# EAGLE schematic brick_i2c_3axis (EAGLE 7.2.0)
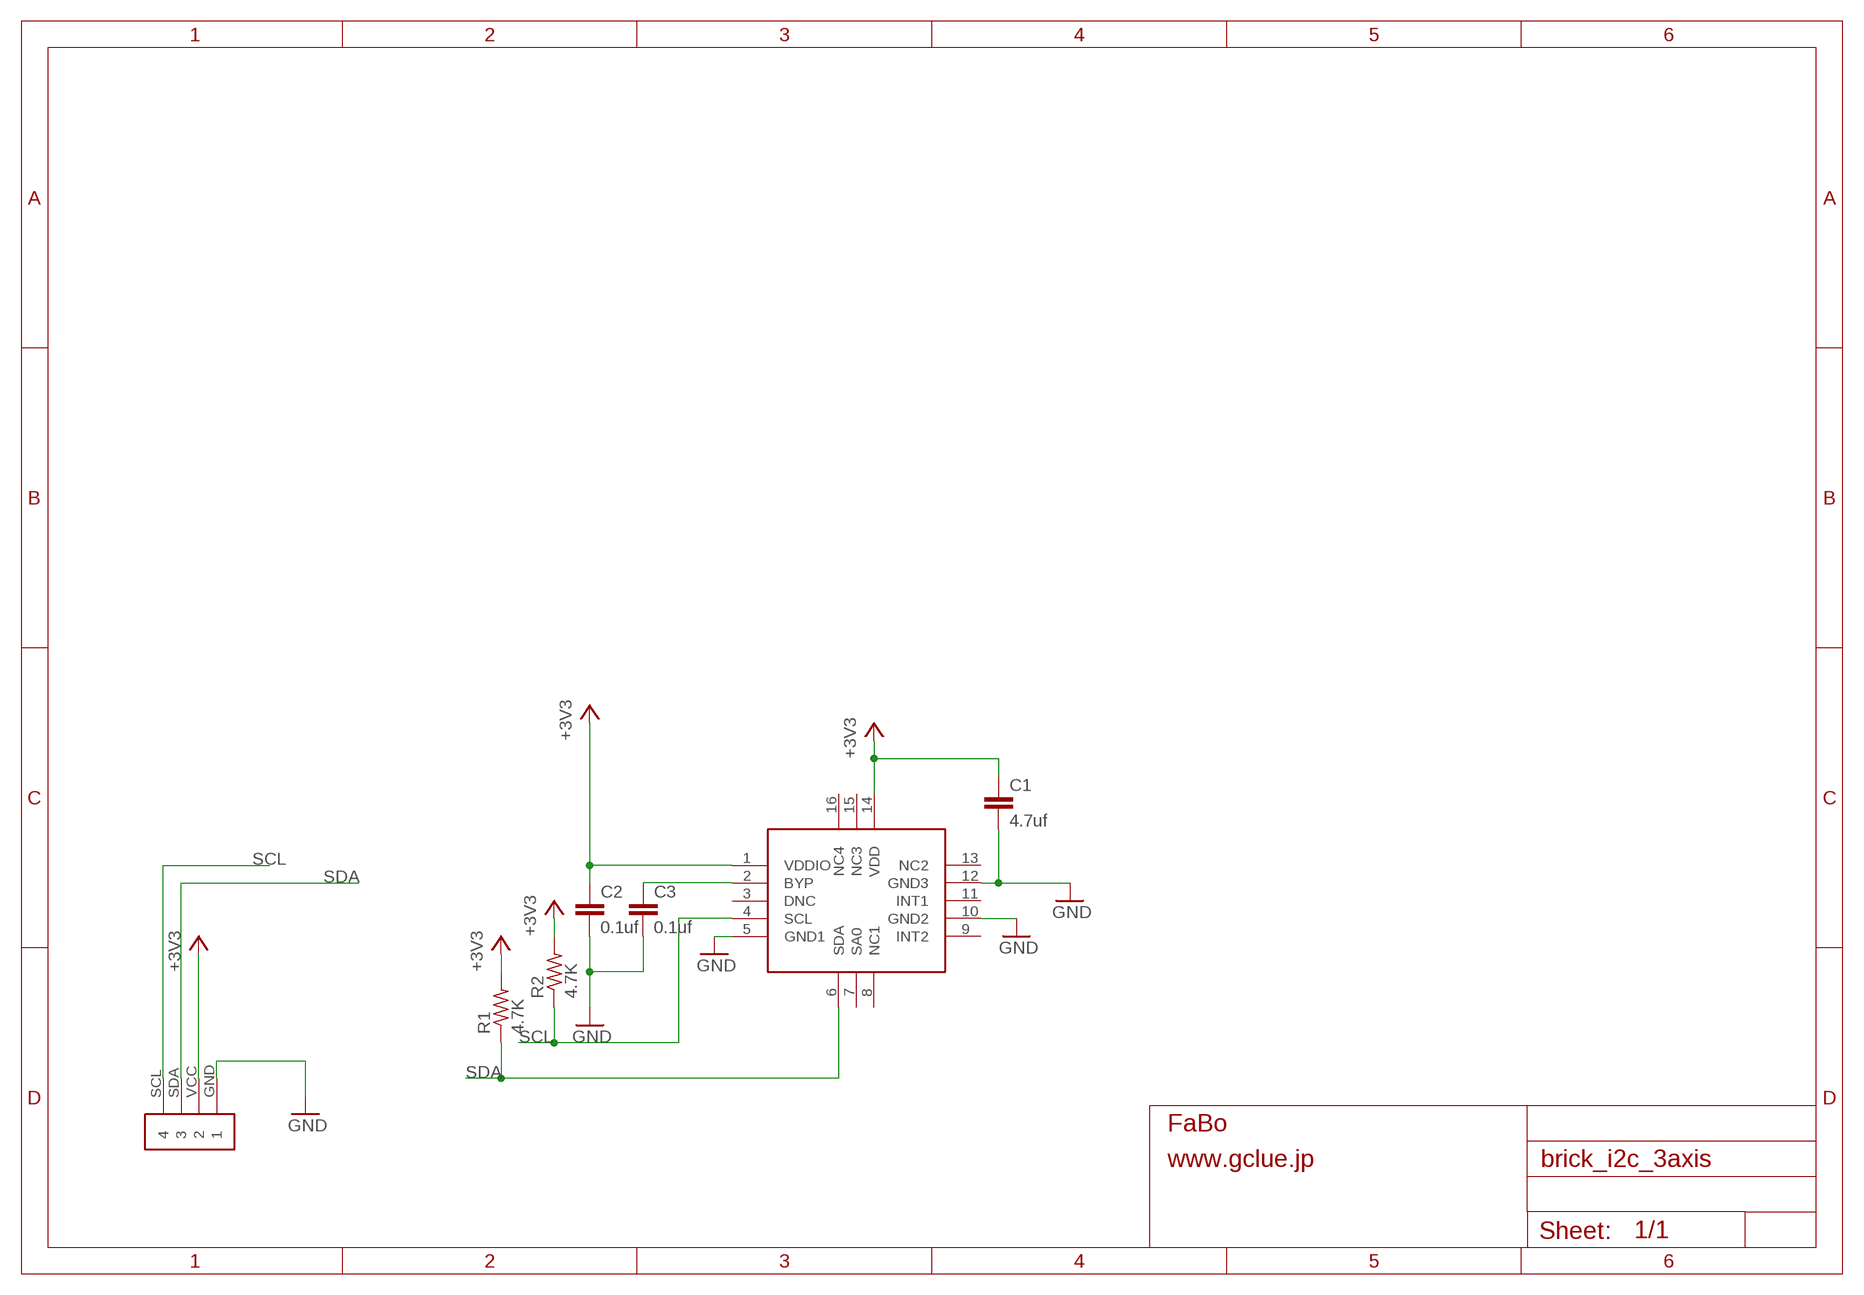
[diagram p0: schematic, sheet 1]

## Parts
C1  4.7uf  C-EUC0603  [C0603]
C2  0.1uf  C-EUC0603  [C0603]
C3  0.1uf  C-EUC0603  [C0603]
MMA1  FREESCALE-MMA8451Q  [FREESCALE-MMA8451Q]
R1  4.7K  R-US_R0603  [R0603]
R2  4.7K  R-US_R0603  [R0603]
U$1  BRICK_I2C  [BRICK_I2C]

## Nets
+3V3: C1.1 C2.1 MMA1.1(VDDIO) MMA1.14(VDD) R1.2 R2.2 U$1.VCC
GND: C1.2 C2.2 C3.2 MMA1.5(GND1) MMA1.10(GND2) MMA1.12(GND3) U$1.GND
N$1: C3.1 MMA1.2(BYP)
SCL: MMA1.4(SCL) R2.1 U$1.SCL
SDA: MMA1.6(SDA) R1.1 U$1.SDA
Unconnected: MMA1.3(DNC) MMA1.7(SA0) MMA1.8(NC1) MMA1.9(INT2) MMA1.11(INT1) MMA1.13(NC2) MMA1.15(NC3) MMA1.16(NC4)

## Library data of the parts
C1-C3 = resistor:C-EU: CAPACITOR, European symbol
MMA1 = gclueSensor:FREESCALE-MMA8451Q
R1 R2 = adafruit:R-US_: RESISTOR, American symbol
U$1 = gclue:BRICK_I2C